# EAGLE design retrocontrolblock-blumenland-terminado-conplanodemasa (EAGLE 7.6.0)
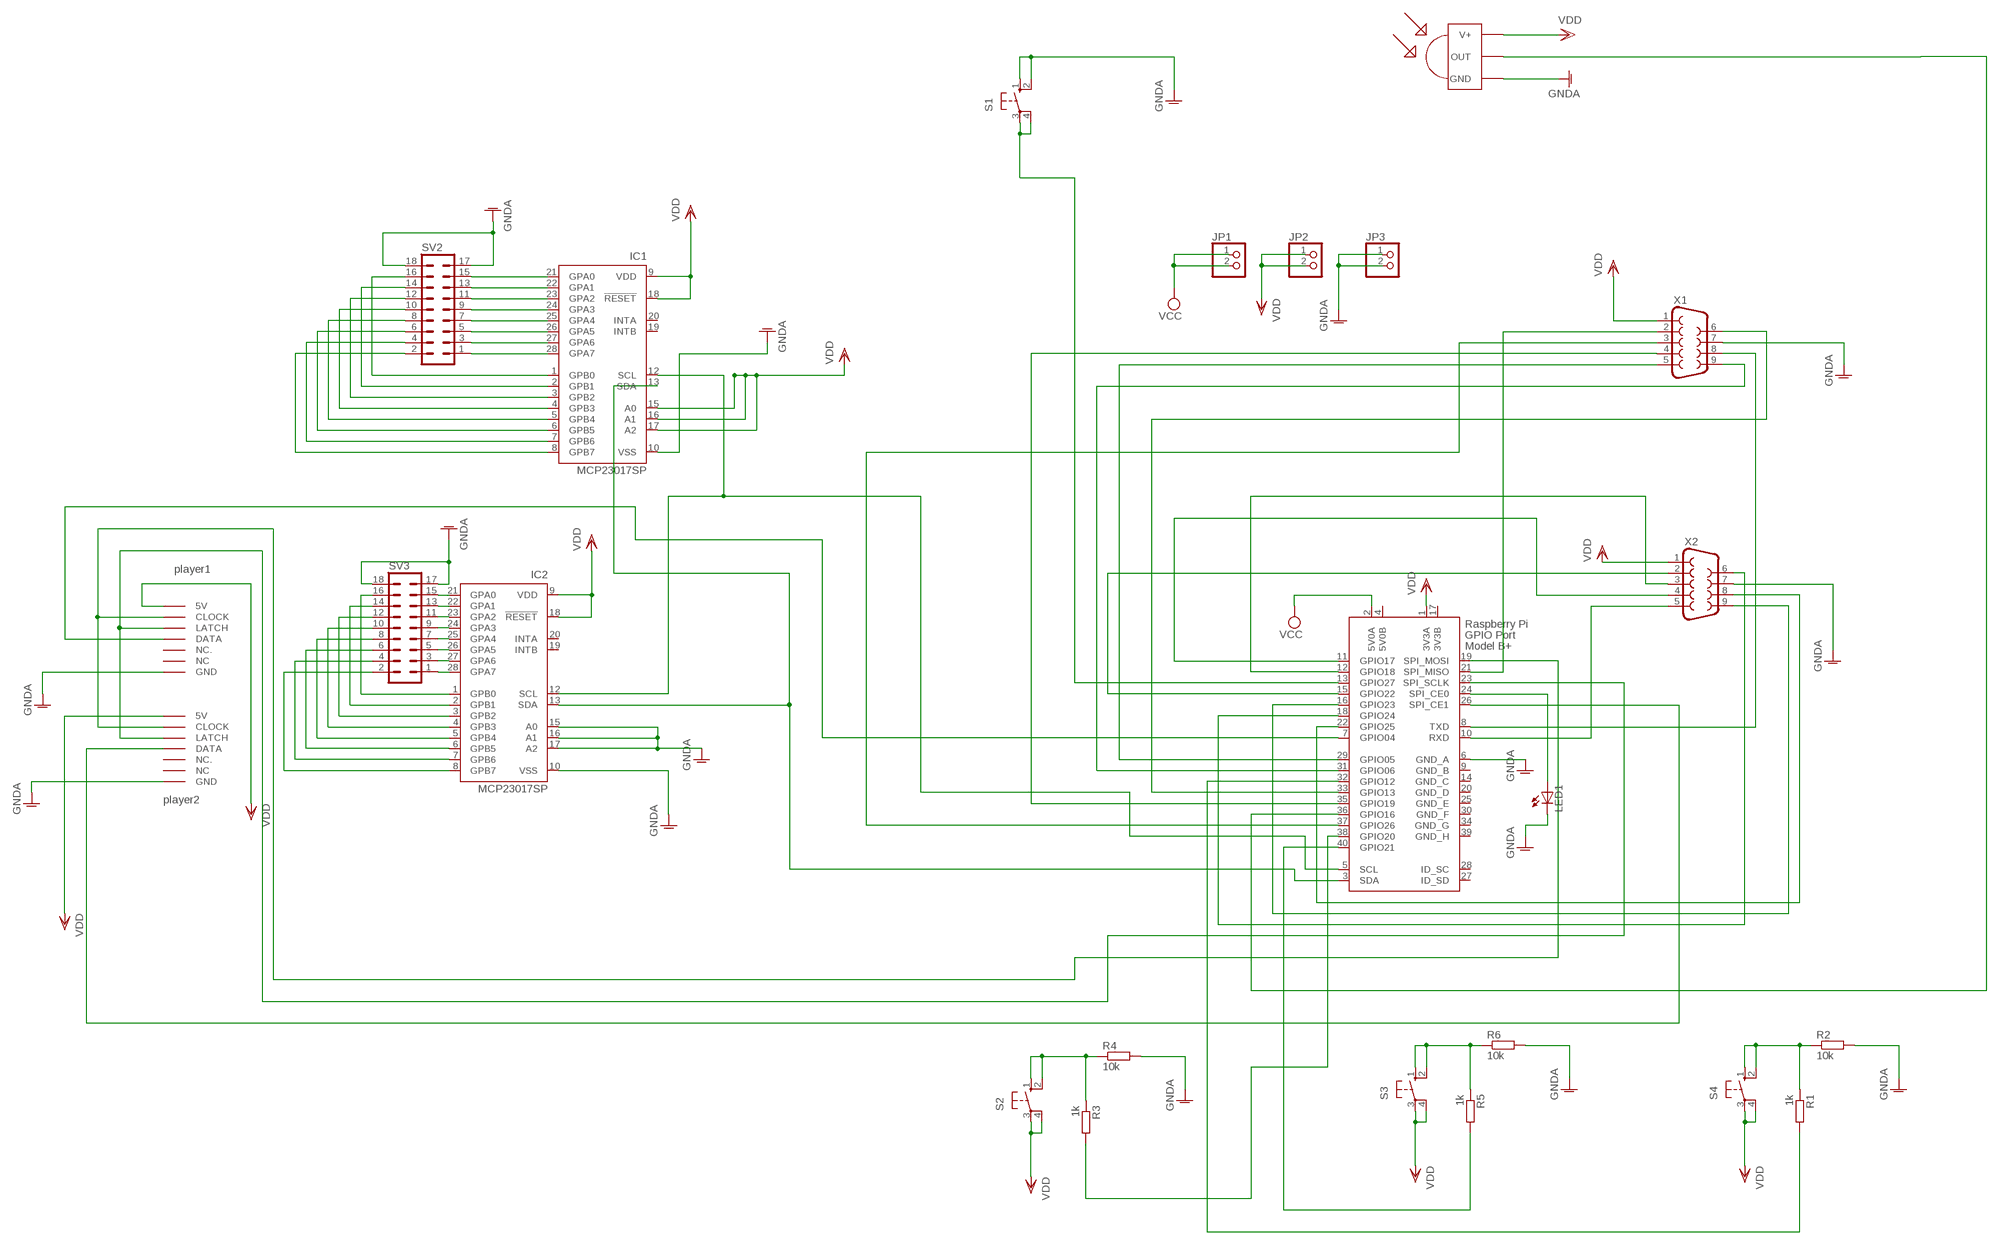
[diagram p0: schematic, sheet 1]

## Parts
IC1  MCP23017SP  [DIL28-3]
IC2  MCP23017SP  [DIL28-3]
JP1  PINHD-1X2  [1X02]
JP2  PINHD-1X2  [1X02]
JP3  PINHD-1X2  [1X02]
LED1  LED5MM  [LED5MM]
R1  1k  R-EU_0207/7  [0207/7]
R2  10k  R-EU_0207/7  [0207/7]
R3  1k  R-EU_0207/7  [0207/7]
R4  10k  R-EU_0207/7  [0207/7]
R5  1k  R-EU_0207/7  [0207/7]
R6  10k  R-EU_0207/7  [0207/7]
S1  10-XX  [B3F-10XX]
S2  10-XX  [B3F-10XX]
S3  10-XX  [B3F-10XX]
S4  10-XX  [B3F-10XX]
SV2  MA09-2  [MA09-2]
SV3  MA09-2  [MA09-2]
U$1  TSOP4838  [TSOP18XX]
U$2  SNESCONN  [SNESCONN]
U$3  SNESCONN  [SNESCONN]
X1  F09H  [F09H]
X2  F09H  [F09H]
X3  RASPI_BOARD_B+#_E0  [RASPI_BOARD_B+_EDGES_0DRILL@1]

## Nets
GNDA: IC1.10(VSS) IC2.10(VSS) IC2.15(A0) IC2.16(A1) IC2.17(A2) JP3.1 JP3.2 LED1.K(C) R2.2 R4.2 R6.2 S1.1(S) S1.2(S1) SV2.17 SV2.18 SV3.17 SV3.18 U$1.GND U$2.GND U$3.GND X1.7 X2.7 X3.6(GND_A)
N$1: IC2.2(GPB1) SV3.14
N$2: LED1.A X3.24(SPI_CE0)
N$3: R3.1 R4.1 S2.1(S) S2.2(S1)
N$4: IC1.21(GPA0) SV2.15
N$5: IC1.28(GPA7) SV2.1
N$6: IC1.1(GPB0) SV2.16
N$7: IC1.8(GPB7) SV2.2
N$8: IC2.21(GPA0) SV3.15
N$9: IC2.28(GPA7) SV3.1
N$10: IC2.1(GPB0) SV3.16
N$11: IC2.8(GPB7) SV3.2
N$12: IC1.22(GPA1) SV2.13
N$13: IC1.23(GPA2) SV2.11
N$14: IC1.24(GPA3) SV2.9
N$15: IC1.25(GPA4) SV2.7
N$16: IC1.26(GPA5) SV2.5
N$18: IC1.27(GPA6) SV2.3
N$19: IC1.2(GPB1) SV2.14
N$20: X2.5 X3.10(RXD)
N$21: IC1.3(GPB2) SV2.12
N$22: X2.3 X3.12(GPIO18)
N$23: IC1.4(GPB3) SV2.10
N$24: IC1.5(GPB4) SV2.8
N$25: R5.1 R6.1 S3.1(S) S3.2(S1)
N$26: IC1.6(GPB5) SV2.6
N$27: IC1.7(GPB6) SV2.4
N$28: IC2.7(GPB6) SV3.4
N$29: IC2.6(GPB5) SV3.6
N$30: IC2.5(GPB4) SV3.8
N$31: IC2.4(GPB3) SV3.10
N$32: IC2.3(GPB2) SV3.12
N$33: X1.5 X3.29(GPIO05)
N$34: X1.8 X3.8(TXD)
N$35: X1.9 X3.31(GPIO06)
N$36: R3.2 X3.38(GPIO20)
N$37: X1.6 X3.33(GPIO13)
N$38: X1.3 X3.37(GPIO26)
N$39: X1.4 X3.35(GPIO19)
N$41: X1.2 X3.21(SPI_MISO)
N$42: X2.4 X3.11(GPIO17)
N$43: S1.3(P) S1.4(P1) X3.13(GPIO27)
N$45: X2.2 X3.15(GPIO22)
N$46: X2.9 X3.16(GPIO23)
N$47: X2.6 X3.18(GPIO24)
N$48: X2.8 X3.22(GPIO25)
N$49: IC2.22(GPA1) SV3.13
N$50: IC2.23(GPA2) SV3.11
N$51: IC2.24(GPA3) SV3.9
N$52: IC2.25(GPA4) SV3.7
N$53: IC2.26(GPA5) SV3.5
N$54: IC2.27(GPA6) SV3.3
N$56: U$1.OUT X3.36(GPIO16)
N$58: U$3.DATA X3.7(GPIO04)
N$59: U$2.CLOCK U$3.CLOCK X3.19(SPI_MOSI)
N$60: U$2.LATCH U$3.LATCH X3.23(SPI_SCLK)
N$61: U$2.DATA X3.26(SPI_CE1)
N$63: R5.2 X3.40(GPIO21)
N$64: R1.1 R2.1 S4.1(S) S4.2(S1)
N$65: R1.2 X3.32(GPIO12)
N$120: IC1.13(SDA) IC2.13(SDA) X3.3(SDA)
N$121: IC1.12(SCL) IC2.12(SCL) X3.5(SCL)
VCC: JP1.1 JP1.2 X3.2(5V0A)
VDD: IC1.9(VDD) IC1.15(A0) IC1.16(A1) IC1.17(A2) IC1.18(!RESET) IC2.9(VDD) IC2.18(!RESET) JP2.1 JP2.2 S2.3(P) S2.4(P1) S3.3(P) S3.4(P1) S4.3(P) S4.4(P1) U$1.VCC(V+) U$2.5V U$3.5V X1.1 X2.1 X3.1(3V3A)
Unconnected: IC1.19(INTB) IC1.20(INTA) IC2.19(INTB) IC2.20(INTA) U$2.NC U$2.NC. U$3.NC U$3.NC. X3.27(ID_SD) X3.28(ID_SC)

## Notes on the sheet
- player1
- player2

## Power pins joined to a net without a drawn wire
3V3B: X3.17(3V3B)
5V0B: X3.4(5V0B)
GND_B: X3.9(GND_B)
GND_C: X3.14(GND_C)
GND_D: X3.20(GND_D)
GND_E: X3.25(GND_E)
GND_F: X3.30(GND_F)
GND_G: X3.34(GND_G)
GND_H: X3.39(GND_H)

## Library data of the parts
IC1 IC2 = microchip:MCP23017: http://ww1.microchip.com/downloads/en/DeviceDoc/21952a.pdf Source: http://ww1.microchip.com/downloads/en/DeviceDoc/21952a.pdf; MF: MICROCHIP; MPN: MCP23017-E/SP; OC_FARNELL: 1332088; OC_NEWARK: 31K2959
JP1-JP3 = pinhead:PINHD-1X2: PIN HEADER
LED1 = led:LED: LED OSRAM: - CHIPLED LG R971, LG N971, LY N971, LG Q971, LY Q971, LO R971, LY R971 LH N974, LH R974 LS Q976, LO Q976, LY Q976 LO Q996 - Hyper CHIPLED LW Q18S LB Q993, LB Q99A, LB R99A - SideLED LS A670, LO A670, LY A670, LG A670, LP A670 LB A673, LV A673, LT A673, LW A673 LH A674 LY A675 LS A676, LA A676, LO A676, LY A676, LW A676 LS A679, LY A679, LG A679 - Hyper Micro SIDELED® LS Y876, LA Y876, LO Y876, LY Y876 LT Y87S - SmartLED LW L88C, LW L88S LB L89C, LB L89S, LG L890 LS L89K, LO L89K, LY L89K LS L896, LA L896, LO L896, LY L896 - TOPLED LS T670, LO T670, LY T670, LG T670, LP T670 LSG T670, LSP T670, LSY T670, LOP T670, LYG T670 LG T671, LOG T671, LSG T671 LB T673, LV T673, LT T673, LW T673 LH T674 LS T676, LA T676, LO T676, LY T676, LB T676, LH T676, LSB T676, LW T676 LB T67C, LV T67C, LT T67C, LS T67K, LO T67K, LY T67K, LW E67C LS E67B, LA E67B, LO E67B, LY E67B, LB E67C, LV E67C, LT E67C LW T67C LS T679, LY T679, LG T679 LS T770, LO T770, LY T770, LG T770, LP T770 LB T773, LV T773, LT T773, LW T773 LH T774 LS E675, LA E675, LY E675, LS T675 LS T776, LA T776, LO T776, LY T776, LB T776 LHGB T686 LT T68C, LB T68C - Hyper Mini TOPLED® LB M676 - Mini TOPLED Santana® LG M470 LS M47K, LO M47K, LY M47K Source: http://www.osram.convergy.de LUXEON: - LUMILED® LXK2-PW12-R00, LXK2-PW12-S00, LXK2-PW14-U00, LXK2-PW14-V00 LXK2-PM12-R00, LXK2-PM12-S00, LXK2-PM14-U00 LXK2-PE12-Q00, LXK2-PE12-R00, LXK2-PE12-S00, LXK2-PE14-T00, LXK2-PE14-U00 LXK2-PB12-K00, LXK2-PB12-L00, LXK2-PB12-M00, LXK2-PB14-N00, LXK2-PB14-P00, LXK2-PB14-Q00 LXK2-PR12-L00, LXK2-PR12-M00, LXK2-PR14-Q00, LXK2-PR14-R00 LXK2-PD12-Q00, LXK2-PD12-R00, LXK2-PD12-S00 LXK2-PH12-R00, LXK2-PH12-S00 LXK2-PL12-P00, LXK2-PL12-Q00, LXK2-PL12-R00 Source: www.luxeon.com KINGBRIGHT: KA-3528ASYC Source: www.kingbright.com
R1-R6 = rcl:R-EU_: RESISTOR, European symbol
S1-S4 = switch-omron:10-XX: OMRON SWITCH; MPN: B3F-1000; OC_FARNELL: 176432; OC_NEWARK: 36M3542
SV2 SV3 = con-lstb:MA09-2: PIN HEADER; OC_FARNELL: unknown; OC_NEWARK: unknown
U$1 = tsop:TSOP4838: IR Receiver and Demodulator
U$2 U$3 = gamepad-conn:SNESCONN
X1 X2 = con-subd:F09: SUB-D; OC_FARNELL: unknown; OC_NEWARK: unknown
X3 = raspberrypi_bastelstube_v13:RASPI_BOARD_B+#: Raspberry Pi GPIO connector with markings for the outer dimensions of the Raspberry Pi board model B+ with different sets of drill holes or mounting pads All pins connected

## Net classes
0 default: width 0.254 mm
1 potencia: width 1.778 mm

## Board
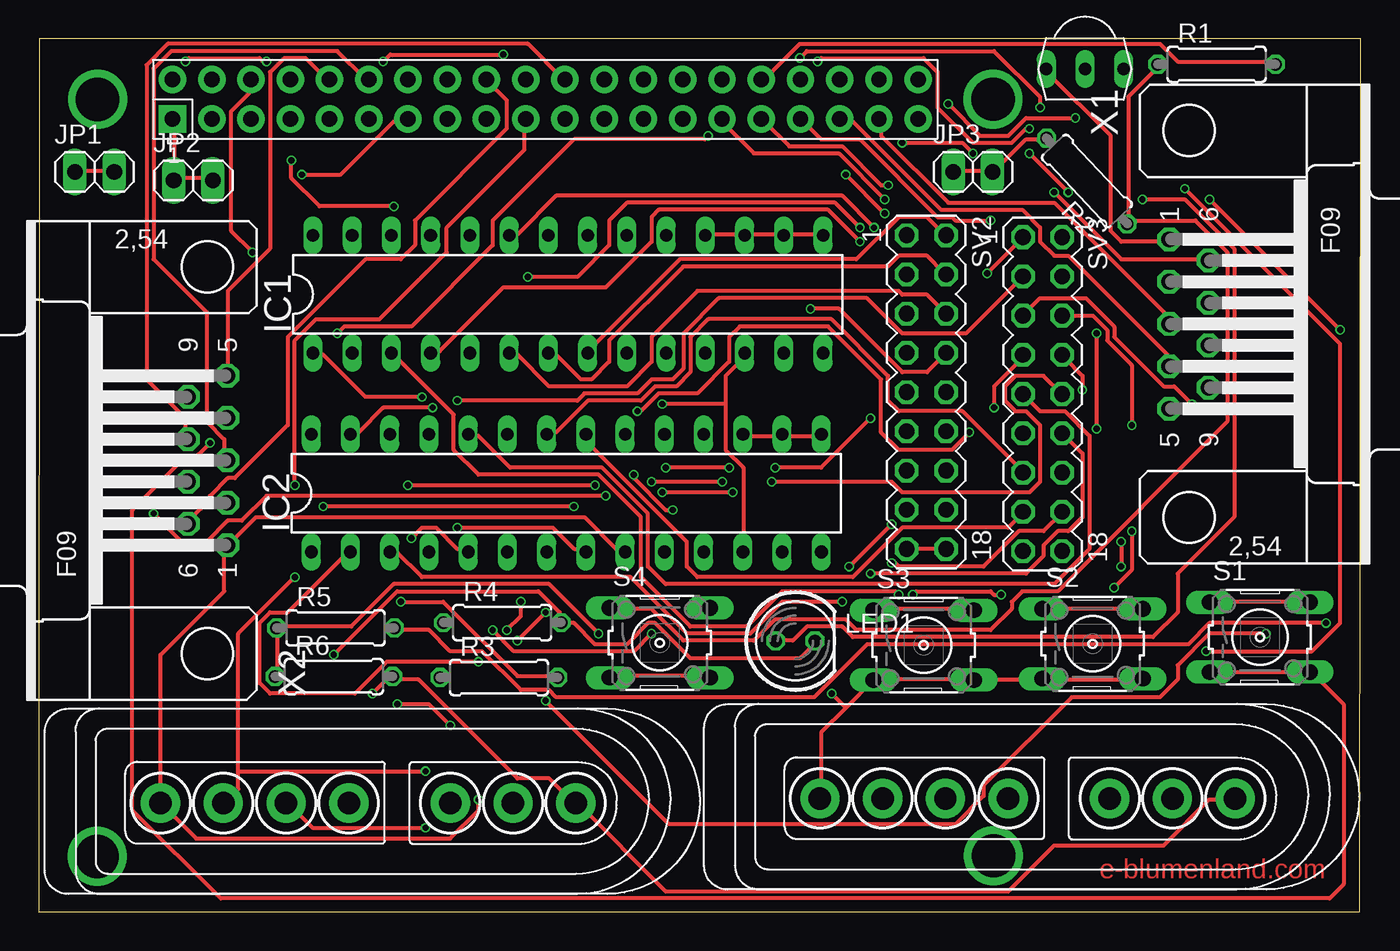
[diagram p1: board, top side]
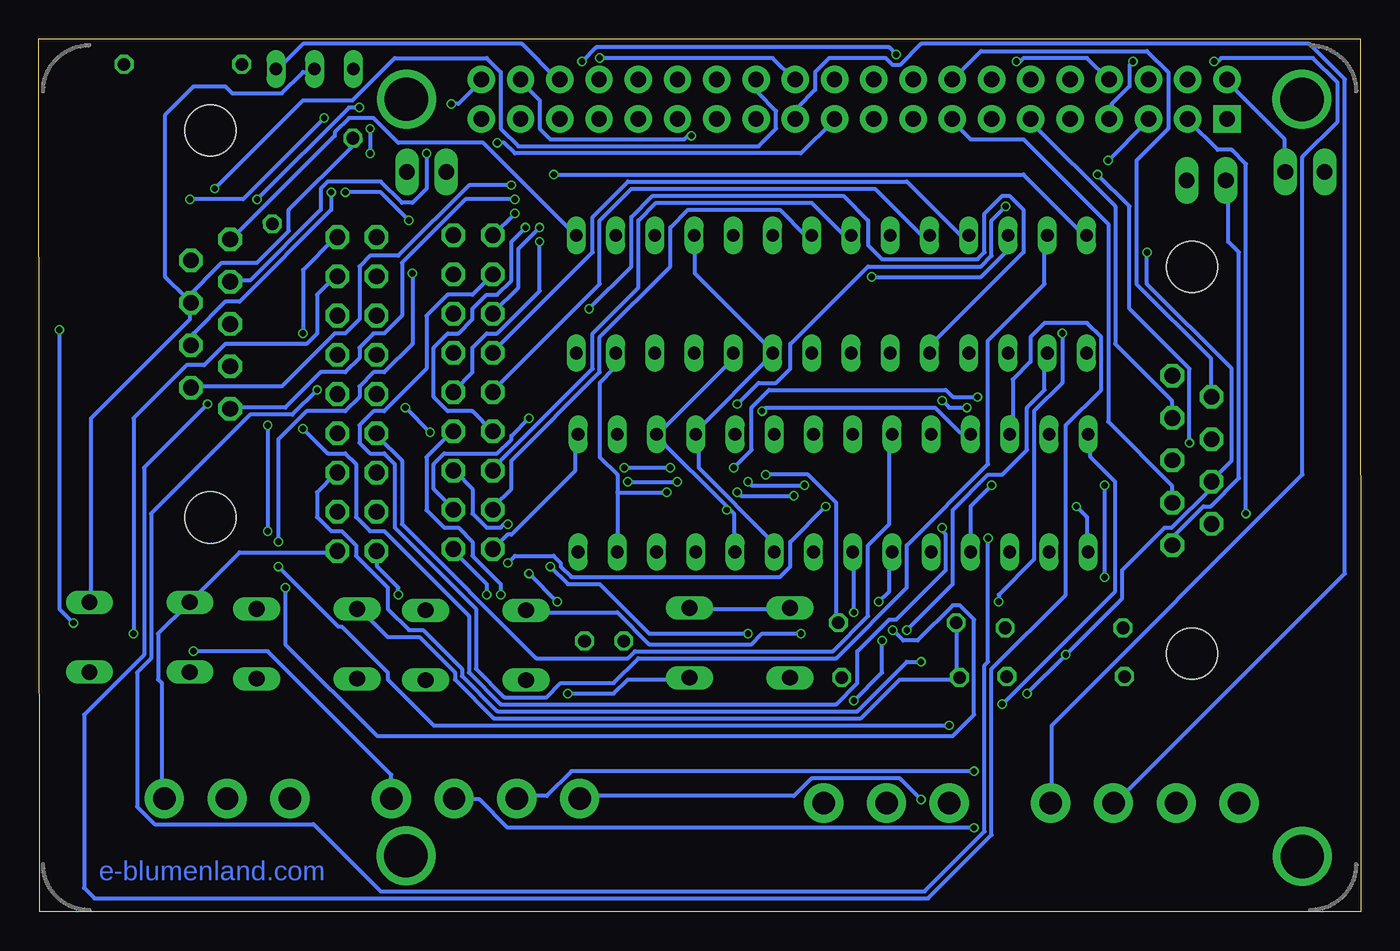
[diagram p2: board, bottom side, seen from below]

Size 85.59 x 56.54 mm. Coordinates in mm from the lower left corner, seen from the top.
Outline: 0,0 85.53,0 85.59,56.53 0.04,56.54 0,0
Copper layers (1*16): Top 0.035mm / dielectric 1.5mm / Bottom 0.035mm
Design rules "default *": minimum track width 10mil, minimum drill 16mil, track to track 8mil, track to pad 8mil, pad to pad 8mil, via to via 8mil, smd to smd 8mil, copper to edge 8mil, drill to drill 8mil, minimum pad ring 0mil, minimum via ring 3mil, stop-mask expansion 0mil, vias tented up to drill 0mil, thermal gap 0mil

### Footprints (pad centres in the part's own frame; a part is rotated, then mirrored left to right if it is on the bottom)
DIL28-3 = drill 0.813 long: 1 -16.51,-3.81; 2 -13.97,-3.81; 3 -11.43,-3.81; 4 -8.89,-3.81; 5 -6.35,-3.81; 6 -3.81,-3.81; 7 -1.27,-3.81; 8 1.27,-3.81; 9 3.81,-3.81; 10 6.35,-3.81; 11 8.89,-3.81; 12 11.43,-3.81; 13 13.97,-3.81; 14 16.51,-3.81; 15 16.51,3.81; 16 13.97,3.81; 17 11.43,3.81; 18 8.89,3.81; 19 6.35,3.81; 20 3.81,3.81; 21 1.27,3.81; 22 -1.27,3.81; 23 -3.81,3.81; 24 -6.35,3.81; 25 -8.89,3.81; 26 -11.43,3.81; 27 -13.97,3.81; 28 -16.51,3.81
1X02 = drill 1.016 long: 1 -1.27,0; 2 1.27,0
LED5MM = drill 0.813 octagon: A -1.27,0; K 1.27,0
0207/7 = drill 0.813 octagon: 1 -3.81,0; 2 3.81,0
B3F-10XX = drill 1.016 long: 1 -3.251,2.261; 2 3.251,2.261; 3 -3.251,-2.261; 4 3.251,-2.261
MA09-2 = drill 1.016 octagon: 1 -10.16,-1.27; 2 -10.16,1.27; 3 -7.62,-1.27; 4 -7.62,1.27; 5 -5.08,-1.27; 6 -5.08,1.27; 7 -2.54,-1.27; 8 -2.54,1.27; 9 0,-1.27; 10 0,1.27; 11 2.54,-1.27; 12 2.54,1.27; 13 5.08,-1.27; 14 5.08,1.27; 15 7.62,-1.27; 16 7.62,1.27; 17 10.16,-1.27; 18 10.16,1.27
TSOP18XX = drill 0.813 long: GND -0.001,-0.027; OUT -2.501,-0.027; VCC 2.499,-0.027
SNESCONN = drill 1.448 pad 2.54: 5V 0,4.064; CLOCK 4.064,4.064; DATA 12.192,4.064; GND 26.884,4.064; LATCH 8.128,4.064; NC 18.756,4.064; NC. 22.82,4.064
F09H = drill 1.016 octagon: 1 -5.486,-1.27; 2 -2.743,-1.27; 3 0,-1.27; 4 2.743,-1.27; 5 5.486,-1.27; 6 -4.115,1.27; 7 -1.372,1.27; 8 1.372,1.27; 9 4.115,1.27 | hole 3.302: -12.522,0; 12.522,0
RASPI_BOARD_B+_EDGES_0DRILL@1 = drill 1 pad 1.778 square: 1 8.37,51.23 | drill 1 pad 1.778: 2 8.37,53.77; 3 10.91,51.23; 4 10.91,53.77; 5 13.45,51.23; 6 13.45,53.77; 7 15.99,51.23; 8 15.99,53.77; 9 18.53,51.23; 10 18.53,53.77; 11 21.07,51.23; 12 21.07,53.77; 13 23.61,51.23; 14 23.61,53.77; 15 26.15,51.23; 16 26.15,53.77; 17 28.69,51.23; 18 28.69,53.77; 19 31.23,51.23; 20 31.23,53.77; 21 33.77,51.23; 22 33.77,53.77; 23 36.31,51.23; 24 36.31,53.77; 25 38.85,51.23; 26 38.85,53.77; 27 41.39,51.23; 28 41.39,53.77; 29 43.93,51.23; 30 43.93,53.77; 31 46.47,51.23; 32 46.47,53.77; 33 49.01,51.23; 34 49.01,53.77; 35 51.55,51.23; 36 51.55,53.77; 37 54.09,51.23; 38 54.09,53.77; 39 56.63,51.23; 40 56.63,53.77

### Placement (x,y rotation side)
IC1  34.26,39.99 0 top
IC2  34.16,27.11 0 top
JP1  3.62,47.9 0 top
JP2  10.01,47.36 0 top
JP3  60.48,47.92 0 top
LED1  48.98,17.54 0 top
R1  76.25,54.88 0 top
R2  67.86,47.32 133.3 top
R3  29.79,15.18 0 top
R4  30.01,18.73 0 top
R5  19.22,18.39 0 top
R6  19.11,15.24 0 top
S1  79.06,17.79 0 top
S2  68.22,17.36 0 top
S3  57.29,17.27 0 top
S4  40.21,17.42 0 top
SV2  57.47,33.66 270 top
SV3  64.99,33.53 270 top
U$1  67.73,54.55 180 top
U$2  50.57,3.28 0 top
U$3  7.89,2.98 0 top
X1  74.46,38.06 270 top
X2  10.93,29.24 90 top
X3  0.3,0.11 0 top

### Tracks (layer width: path | path; a pad name or v marks a point on that pad's centre or on a via)
GNDA  (via drill 0.41)
  Top 0.254: R2.2 65.05,50.03 63.91,50.03 61.85,47.97 JP3.2 61.62,47.97 59.33,47.97 JP3.1 | S1.1 76.02,20.08 82.19,20.08 S1.2 | SV2.17 56.36,23.51 58.65,23.51 SV2.18 | v62.31,20.54 61.85,20.54 61.62,20.76 56.82,20.76 v56.59,20.54 | 48.13,30.82 45.62,30.82 IC2.17 | 48.13,30.82 50.65,30.82 IC2.15 | 48.13,30.82 IC2.16 | LED1.K 50.19,17.34 49.28,16.42 42.19,16.42 39.9,18.71 39.45,18.71 38.07,17.34 36.02,17.34 34.65,18.71 33.96,18.71 R4.2 33.73,18.94 33.73,19.39 32.36,20.76 23.22,20.76 v19.1,16.65 | v21.62,14.14 22.76,15.28 R6.2 22.99,15.05 24.59,15.05 30.99,8.65 33.05,8.65 34.65,7.05 U$3.GND 34.87,7.05 40.59,1.33 62.76,1.33 65.73,4.31 72.82,4.31 75.79,7.28 77.39,7.28 U$2.GND | v13.84,42.71 12.47,44.08 12.47,51.85 13.61,53 13.61,53.68 X3.6 | v41.05,26.02 40.59,26.02 38.53,28.08 v38.53,28.31
  Bottom 0.254: 76.02,39.74 75.79,39.51 X1.7 | 76.02,39.74 77.39,41.11 77.39,51.63 75.56,53.45 73.51,53.45 73.05,53 69.85,53 68.48,54.37 67.79,54.37 U$1.GND | 76.02,39.74 73.74,42.02 71.45,42.02 69.39,44.08 69.39,45.45 65.28,49.57 65.28,50.03 R2.2 | 76.02,39.74 X1.7 | SV3.18 66.42,23.28 72.59,23.28 75.79,20.08 S1.1 76.02,19.85 77.85,18.02 77.85,15.05 77.62,14.82 77.62,7.51 U$2.GND | X1.7 75.79,39.28 75.79,38.37 82.19,31.97 82.19,20.08 S1.2 | v62.31,20.54 62.31,20.99 63.68,22.36 63.68,23.28 SV3.17 | v56.59,20.54 56.59,21.22 58.65,23.28 SV2.18 | 41.05,26.25 45.62,30.82 IC2.17 45.39,31.05 40.82,35.62 40.82,36.08 IC1.10 | 41.05,26.25 40.59,25.79 40.59,23.51 IC2.10 | SV2.17 56.13,23.51 55.22,24.42 54.99,24.42 50.88,28.54 50.88,30.82 IC2.15 | v21.62,14.14 v19.1,16.65 15.44,20.31 15.44,22.14 12.7,24.88 12.24,24.88 9.73,27.39 9.73,27.85 X2.7 9.5,28.08 8.36,29.22 8.36,35.17 13.84,40.65 v13.84,42.71 | v41.05,26.02 41.05,26.25 | v38.53,28.31 35.79,28.31 33.96,26.48 33.96,18.94 R4.2
N$1  (via drill 0.41)
  Top 0.254: v28.47,16.19 22.53,16.19 20.47,14.14 14.99,14.14 14.3,14.82 14.3,18.71 14.99,19.39 16.13,19.39 20.01,23.28 IC2.2
  Bottom 0.254: v28.47,16.19 29.39,16.19 32.59,12.99 55.91,12.99 58.19,15.28 58.19,15.74 60.71,18.25 61.62,18.25 62.99,19.62 62.99,20.99 65.05,23.05 65.05,23.74 65.96,24.65 66.65,24.65 67.56,25.57 67.56,27.17 66.42,28.31 SV3.14
N$2  (via drill 0.41)
  Top 0.254: v71.45,46.14 74.19,46.14 77.39,42.94 77.39,25.57 73.74,21.91 73.74,19.39 72.14,17.79 52.7,17.79 52.02,18.48 49.73,18.48 48.82,17.56 47.9,17.56 LED1.A | v64.82,52.08 64.82,52.77 61.85,55.74 49.73,55.74 v49.28,55.28
  Bottom 0.254: v71.45,46.14 65.51,52.08 v64.82,52.08 | v49.28,55.28 38.07,55.28 36.7,53.91 X3.24
N$3
  Top 0.254: S2.2 S2.1
  Bottom 0.254: R4.1 26.19,18.71 26.19,15.28 R3.1 26.19,15.05 29.84,15.05 32.36,12.54 56.13,12.54 58.65,15.05 58.65,15.51 60.93,17.79 62.99,17.79 64.82,19.62 S2.1
N$4
  Bottom 0.254: IC1.21 35.56,43.85 36.02,43.85 37.62,45.45 43.56,45.45 44.7,44.31 44.7,41.8 49.28,37.22 49.28,34.94 54.99,29.22 54.99,27.39 56.13,26.25 SV2.15
N$5  (via drill 0.41)
  Top 0.254: v54.76,45.22 v52.25,47.74
  Bottom 0.254: v52.25,47.74 21.84,47.74 17.96,43.85 IC1.28 | v54.76,45.22 56.13,43.85 SV2.1
N$6  (via drill 0.41)
  Top 0.254: v24.82,33.34 21.16,33.34 18.41,36.08 17.96,36.08 IC1.1 | v44.7,28.77 v40.59,28.77 | v47.68,28.77 50.65,28.77 v53.85,31.97
  Bottom 0.254: v24.82,33.34 26.42,33.34 26.87,33.79 38.3,33.79 39.45,32.65 39.45,29.91 v40.59,28.77 | v47.68,28.77 v44.7,28.77 | v53.85,31.97 54.99,30.82 54.99,30.59 55.91,29.68 59.33,29.68 60.02,28.99 60.02,27.39 58.88,26.25 SV2.16
N$7
  Top 0.254: IC1.8 35.56,36.31 41.5,42.25 52.93,42.25 55.68,45 57.51,45 58.65,43.85 SV2.2
N$8
  Top 0.254: IC2.21 35.56,30.82 35.56,30.37 41.96,23.97 41.96,22.36 42.65,21.68 52.7,21.68 55.91,24.88 62.76,24.88 63.68,25.79 SV3.15
N$9  (via drill 0.41)
  Top 0.254: v23.22,13.45 25.27,13.45 v26.64,12.08 | v70.08,23.97 v70.08,22.36 | v61.39,41.34 63.68,43.62 SV3.1
  Bottom 0.254: v23.22,13.45 15.9,20.76 15.9,27.85 17.5,29.45 17.5,30.82 IC2.28 | v26.64,12.08 60.02,12.08 62.99,15.05 62.99,15.51 65.96,18.48 66.19,18.48 v70.08,22.36 | v70.08,23.97 70.08,30.59 68.25,32.42 65.73,32.42 64.82,33.34 64.82,34.02 63.91,34.94 63.22,34.94 61.39,36.77 v61.39,41.34
N$10  (via drill 0.41)
  Top 0.254: v34.65,26.25 v18.41,26.25 | v55.22,22.59 55.45,22.59 55.68,22.36 61.16,22.36 63.45,24.65 65.05,24.65 66.19,25.79 SV3.16
  Bottom 0.254: v18.41,26.25 17.73,25.57 17.73,23.51 IC2.1 | v34.65,26.25 36.93,23.97 36.93,22.36 37.62,21.68 51.1,21.68 51.79,22.36 51.79,22.59 52.25,23.05 54.76,23.05 v55.22,22.59
N$11  (via drill 0.41)
  Top 0.254: v27.1,24.88 33.27,24.88 34.65,23.51 35.33,23.51 IC2.8 | v68.48,37.45 v68.48,31.28
  Bottom 0.254: v27.1,24.88 27.1,24.65 26.87,24.42 26.87,22.14 30.07,18.94 30.53,18.94 32.59,16.88 32.59,14.82 33.96,13.45 55.68,13.45 57.73,15.51 57.73,19.16 63.22,24.65 64.13,24.65 65.05,25.57 65.05,28.99 65.73,29.68 66.88,29.68 v68.48,31.28 | v68.48,37.45 68.48,41.57 66.42,43.62 SV3.2
N$12
  Bottom 0.254: IC1.22 33.05,43.85 33.5,43.85 35.56,45.91 45.62,45.91 46.76,44.77 46.76,40.42 49.73,37.45 49.73,35.17 56.13,28.77 SV2.13
N$13  (via drill 0.41)
  Top 0.254: v54.08,44.31 52.02,46.37 33.5,46.37 30.99,43.85 30.53,43.85 IC1.23
  Bottom 0.254: v54.08,44.31 54.99,43.4 54.99,40.88 55.91,39.97 56.59,39.97 57.51,39.05 57.51,38.37 58.42,37.45 59.11,37.45 60.02,36.54 60.02,33.34 59.11,32.42 57.51,32.42 SV2.11
N$14
  Bottom 0.254: IC1.24 28.02,43.85 28.47,43.85 31.44,46.83 47.22,46.83 49.28,44.77 49.28,40.65 56.13,33.79 SV2.9
N$15
  Bottom 0.254: IC1.25 25.5,43.85 25.96,43.85 29.39,47.28 47.45,47.28 49.73,45 49.73,42.71 56.13,36.31 SV2.7
N$16  (via drill 0.41)
  Top 0.254: v31.67,41.11 34.87,41.11 36.93,43.17 36.93,44.77 38.07,45.91 51.56,45.91 v53.16,44.31
  Bottom 0.254: v31.67,41.11 24.59,41.11 22.99,42.71 22.99,43.62 IC1.26 | v53.16,44.31 54.53,42.94 54.53,40.42 56.13,38.82 SV2.5
N$18
  Bottom 0.254: SV2.3 57.51,39.97 59.11,39.97 60.48,38.6 60.48,35.17 63.22,32.42 63.91,32.42 64.82,31.51 64.82,30.37 64.13,29.68 63.22,29.68 62.53,28.99 62.53,24.88 57.28,19.62 57.28,15.74 55.45,13.91 52.7,13.91 51.79,14.82 48.36,14.82 46.76,16.42 33.96,16.42 29.39,20.99 29.39,23.74 24.13,28.99 24.13,37 20.47,40.65 20.47,43.62 IC1.27
N$19  (via drill 0.41)
  Top 0.254: v29.39,18.25 30.76,16.88 38.53,16.88 v39.67,18.02 | v55.22,25.11 v52.48,22.36
  Bottom 0.254: v29.39,18.25 26.42,21.22 26.42,26.02 24.13,28.31 23.22,28.31 21.62,29.91 21.62,32.65 20.47,33.79 20.47,36.08 IC1.2 | v39.67,18.02 46.08,18.02 49.28,21.22 51.33,21.22 v52.48,22.36 | v55.22,25.11 55.45,25.11 55.68,24.88 56.59,24.88 57.51,25.79 57.51,27.39 58.65,28.54 SV2.14
N$20
  Top 0.254: X2.5 12.24,34.94 12.24,40.2 14.99,42.94 14.99,54.37 15.9,55.28 17.27,55.28 18.64,53.91 X3.10
N$21  (via drill 0.41)
  Top 0.254: v55.68,20.54 55.45,20.76 48.13,20.76 45.85,18.48 42.19,18.48 38.99,21.68 38.99,25.57 36.25,28.31 28.47,28.31 26.87,29.91 26.87,32.19 22.99,36.08 IC1.3
  Bottom 0.254: v55.68,20.54 55.68,21.22 57.51,23.05 57.51,23.97 58.42,24.88 59.33,24.88 60.48,26.02 60.48,29.45 58.88,31.05 SV2.12
N$22
  Top 0.254: X2.3 12.01,29.45 12.01,30.59 10.87,31.74 10.87,38.82 7.44,42.25 7.44,54.6 8.58,55.74 19.33,55.74 21.16,53.91 X3.12
N$23  (via drill 0.41)
  Top 0.254: v53.16,43.4 51.1,45.45 40.13,45.45 39.67,45 39.67,43.4 36.7,40.42 30.07,40.42 25.96,36.31 25.5,36.31 IC1.4
  Bottom 0.254: v53.16,43.4 53.16,40.2 55.91,37.45 56.59,37.45 57.51,36.54 57.51,34.94 58.65,33.79 SV2.10
N$24  (via drill 0.41)
  Top 0.254: v49.96,39.05 51.79,39.05 55.91,34.94 57.51,34.94 58.65,36.08 SV2.8
  Bottom 0.254: v49.96,39.05 47.22,41.8 47.22,45 45.85,46.37 33.5,46.37 31.9,44.77 31.9,43.17 30.99,42.25 24.82,42.25 24.36,42.71 24.36,45.22 23.22,46.37 22.76,46.37 21.84,45.45 21.84,42.71 27.79,36.77 27.79,36.31 IC1.5
N$25  (via drill 0.41)
  Top 0.254: R6.1 15.44,15.28 15.44,18.25 R5.1 15.44,18.48 20.24,18.48 22.99,21.22 33.05,21.22 v36.25,18.02 | S3.1 54.08,19.62 60.48,19.62 S3.2
  Bottom 0.254: v36.25,18.02 38.76,18.02 39.45,17.34 46.08,17.34 48.13,19.39 53.85,19.39 S3.1
N$26
  Top 0.254: SV2.6 57.51,39.97 55.91,39.97 55.68,40.2 42.65,40.2 39.67,37.22 39.67,35.62 38.07,34.02 33.05,34.02 30.99,36.08 30.53,36.08 IC1.6
N$27
  Top 0.254: IC1.7 33.05,36.08 33.5,36.08 35.1,34.48 35.79,34.48 36.93,35.62 36.93,37 41.73,41.8 54.99,41.8 55.68,42.48 57.51,42.48 58.65,41.34 SV2.4
N$28  (via drill 0.41)
  Top 0.254: v30.99,17.56 v32.82,19.39 | v32.82,13.68 40.82,5.68 59.33,5.68 61.16,7.51 61.16,8.19 66.88,13.91 72.59,13.91 73.74,15.05 73.74,15.96 75.79,18.02 v79.45,18.02
  Bottom 0.254: v32.82,19.39 32.82,23.28 IC2.7 | v30.99,17.56 30.99,15.51 v32.82,13.68 | v79.45,18.02 79.45,31.97 76.02,35.4 74.88,35.4 73.51,36.77 68.25,36.77 67.56,37.45 67.56,39.97 66.42,41.11 SV3.4
N$29  (via drill 0.41)
  Top 0.254: v31.22,20.08 31.22,19.16 v30.3,18.25 | v69.62,20.99 70.76,22.14 v70.76,24.65 | v70.76,31.51 70.76,35.4 69.16,37 69.16,37.68 68.25,38.6 66.42,38.6 SV3.6
  Bottom 0.254: v31.22,20.08 30.53,20.76 30.53,23.28 IC2.6 | v30.3,18.25 29.62,17.56 28.7,17.56 26.42,19.85 25.96,19.85 25.04,18.94 25.04,12.76 26.42,11.39 63.68,11.39 69.62,17.34 v69.62,20.99 | v70.76,31.51 v70.76,24.65
N$30  (via drill 0.41)
  Top 0.254: v24.13,24.19 24.82,24.88 25.73,24.88 27.1,23.51 27.79,23.51 IC2.5 | v67.56,33.79 67.56,34.71 66.42,35.85 SV3.8
  Bottom 0.254: v24.13,24.19 24.13,16.19 24.36,15.96 24.36,5.22 28.24,1.33 63.45,1.33 67.79,5.68 78.08,5.68 79.22,6.82 79.22,15.51 78.31,16.42 78.31,25.79 71.91,32.19 69.16,32.19 v67.56,33.79
N$31  (via drill 0.41)
  Top 0.254: v36.02,27.62 v23.9,27.62 | v44.25,27.85 v39.67,27.85 | v47.45,27.85 55.22,27.85 55.91,27.17 64.13,27.17 64.82,27.85 64.82,31.51 63.91,32.42 63.22,32.42 62.53,33.11 62.53,34.02 63.22,34.71 65.05,34.71 66.19,33.57 SV3.10
  Bottom 0.254: IC2.4 25.27,26.25 v23.9,27.62 | v36.02,27.62 39.45,27.62 v39.67,27.85 | v47.45,27.85 v44.25,27.85
N$32  (via drill 0.41)
  Top 0.254: v52.02,20.08 48.13,20.08 46.08,18.02 41.96,18.02 38.3,21.68 24.82,21.68 23.22,23.28 22.76,23.28 IC2.3 | v53.85,21.91 63.91,21.91 65.05,23.05 65.05,23.74 65.96,24.65 66.65,24.65 67.56,25.57 67.56,29.68 SV3.12
  Bottom 0.254: v53.85,21.91 v52.02,20.08
N$33  (via drill 0.41)
  Top 0.254: v54.76,46.14 51.79,49.11 46.3,49.11 44.25,51.17 X3.29
  Bottom 0.254: v54.76,46.14 57.96,46.14 62.08,42.02 62.08,38.6 63.22,37.45 63.91,37.45 64.82,36.54 64.82,35.85 65.73,34.94 67.34,34.94 69.62,32.65 73.05,32.65 X1.5
N$34  (via drill 0.41)
  Top 0.254: v64.13,49.11 v66.65,46.6 | v64.13,50.71 63.91,50.71 62.99,49.8 60.48,49.8 58.19,52.08 58.19,54.37 57.28,55.28 50.65,55.28 v50.42,55.05 | v30.07,55.51 22.76,55.51 v22.3,55.05
  Bottom 0.254: v66.65,46.6 66.65,45.45 72.59,39.51 73.51,39.51 75.56,37.45 75.56,36.77 X1.8 | v64.13,50.71 v64.13,49.11 | v50.42,55.05 49.5,55.97 30.53,55.97 v30.07,55.51 | v22.3,55.05 22.07,55.05 21.84,55.28 17.73,55.28 16.36,53.91 X3.8
N$35  (via drill 0.41)
  Top 0.254: v54.99,47.05 54.53,47.05 52.02,49.57 48.59,49.57 46.99,51.17 X3.31
  Bottom 0.254: v54.99,47.05 57.73,47.05 62.31,42.48 64.13,42.48 64.82,41.8 64.82,38.37 65.73,37.45 66.42,37.45 69.85,34.02 75.56,34.02 X1.9
N$36  (via drill 0.41)
  Top 0.254: v23.44,20.08 26.19,20.08 30.99,15.28 33.5,15.28 R3.2 | v19.33,37.45 19.79,37.91 24.13,37.91 29.39,43.17 29.39,44.77 34.65,50.03 43.1,50.03 v43.33,50.25
  Bottom 0.254: v23.44,20.08 23.44,20.54 21.16,22.82 21.16,32.42 19.33,34.25 v19.33,37.45 | v43.33,50.25 43.56,50.25 43.79,50.03 52.48,50.03 53.16,50.71 53.16,52.54 54.3,53.68 X3.38
N$37  (via drill 0.41)
  Top 0.254: v65.73,46.6 70.08,42.25 75.56,42.25 X1.6 | v61.62,44.77 59.33,44.77 59.11,45 58.19,45 53.16,50.03 50.65,50.03 49.5,51.17 X3.33
  Bottom 0.254: v65.73,46.6 63.45,46.6 v61.62,44.77
N$38
  Top 0.254: X1.3 73.05,38.14 73.05,38.6 65.73,45.91 58.88,45.91 54.53,50.25 54.53,51.17 X3.37
N$39
  Top 0.254: X1.4 73.05,35.4 73.05,36.08 66.65,42.48 65.73,42.48 64.82,43.4 64.82,44.31 63.68,45.45 58.42,45.45 52.7,51.17 52.02,51.17 X3.35
N$40  (via drill 2.8 pad 3.81)
  other vias: 3.8,3.59
N$41  (via drill 0.41)
  Top 0.254: v60.48,49.11 59.79,49.8 v55.91,49.8
  Bottom 0.254: v60.48,49.11 60.48,46.83 61.39,45.91 62.08,45.91 63.45,47.28 66.88,47.28 67.34,46.83 67.34,45.45 71.91,40.88 73.05,40.88 X1.2 | v55.91,49.8 55.45,49.8 54.76,49.11 36.25,49.11 34.19,51.17 X3.21
N$42
  Bottom 0.254: X2.4 12.24,32.19 12.24,33.11 15.9,36.77 15.9,45.68 21.39,51.17 X3.11
N$43  (via drill 0.41)
  Top 0.254: S1.3 76.02,15.51 82.19,15.51 S1.4 82.42,15.51 84.48,13.45 84.48,1.79 83.57,0.88 11.79,0.88 6.07,6.59 6.07,26.02 9.04,28.99 9.73,28.99 v11.1,30.37 | v17.04,47.74 19.56,47.74 22.99,51.17 23.9,51.17 X3.13
  Bottom 0.254: v17.04,47.74 14.99,45.68 14.99,39.05 11.1,35.17 v11.1,30.37
N$44  (via drill 2.8 pad 3.81)
  other vias: 61.81,3.63
N$45
  Bottom 0.254: X2.2 12.24,26.71 12.24,27.62 16.36,31.74 16.36,44.54 21.84,50.03 25.27,50.03 26.42,51.17 X3.15
N$46
  Bottom 0.254: X2.9 9.73,33.57 9.73,35.85 14.53,40.65 14.53,48.65 12.47,50.71 12.47,54.37 13.84,55.74 24.59,55.74 26.42,53.91 X3.16
N$47
  Top 0.254: X2.6 9.73,25.34 11.1,26.71 11.1,26.94 12.24,28.08 12.7,28.08 16.13,31.51 16.13,37.22 21.16,42.25 23.44,42.25 24.36,43.17 24.36,44.77 30.3,50.71 30.3,52.54 29.16,53.68 X3.18
N$48
  Top 0.254: X2.8 9.5,30.82 9.5,31.97 6.98,34.48 6.98,54.83 8.36,56.2 31.67,56.2 33.96,53.91 X3.22
N$49
  Top 0.254: IC2.22 33.05,31.05 33.5,31.05 35.56,33.11 38.99,33.11 39.9,34.02 41.27,34.02 42.19,34.94 42.19,37.22 43.33,38.37 51.33,38.37 54.99,34.71 54.99,33.11 55.68,32.42 59.79,32.42 63.68,28.54 SV3.13
N$50
  Bottom 0.254: IC2.23 30.53,30.82 30.53,25.11 31.9,23.74 31.9,19.16 34.19,16.88 46.99,16.88 47.45,16.42 53.39,16.42 62.08,25.11 62.08,29.22 63.68,30.82 SV3.11
N$51
  Top 0.254: SV3.9 64.82,32.42 66.42,32.42 68.02,30.82 68.02,23.51 65.73,21.22 40.59,21.22 39.45,22.36 39.45,25.79 36.47,28.77 30.53,28.77 28.47,30.82 28.02,30.82 IC2.24
N$52  (via drill 0.41)
  Top 0.254: v38.76,32.42 38.99,32.42 40.13,33.57 42.65,33.57 44.7,35.62 44.7,37.22 45.39,37.91 51.1,37.91 54.53,34.48 54.53,31.05 55.68,29.91 59.11,29.91 v60.25,31.05 | v61.85,32.65 61.85,34.02 63.68,35.85 SV3.7
  Bottom 0.254: v38.76,32.42 38.53,32.65 27.56,32.65 25.96,31.05 25.27,31.05 IC2.25 | v61.85,32.65 v60.25,31.05
N$53  (via drill 0.41)
  Top 0.254: v74.65,32.88 73.51,34.02 72.82,34.02 69.62,37.22 69.62,37.91 67.79,39.74 64.82,39.74 63.91,38.82 SV3.5
  Bottom 0.254: v74.65,32.88 78.77,28.77 78.77,16.65 82.65,12.76 82.65,1.56 81.97,0.88 28.02,0.88 23.9,4.99 23.9,15.74 19.1,20.54 19.1,31.51 16.81,33.79 16.81,37.22 17.73,38.14 20.47,38.14 21.39,37.22 21.39,35.62 22.53,34.48 22.53,31.05 IC2.26
N$54  (via drill 0.41)
  Top 0.254: v25.5,32.65 22.3,32.65 20.7,31.05 20.24,31.05 IC2.27 | v27.1,33.11 34.87,33.11 35.33,33.57 38.76,33.57 39.67,34.48 41.05,34.48 41.73,35.17 41.73,37.45 44.02,39.74 53.62,39.74 55.91,37.45 60.02,37.45 SV3.3
  Bottom 0.254: v25.5,32.65 26.64,32.65 v27.1,33.11
N$55  (via drill 2.8 pad 3.81)
  other vias: 61.79,52.62
N$56
  Bottom 0.254: U$1.OUT 70.08,54.6 68.48,56.2 54.3,56.2 52.02,53.91 X3.36
N$57  (via drill 2.8 pad 3.81)
  other vias: 3.81,52.6
N$58  (via drill 0.41)
  Top 0.254: v14.76,55.05 14.53,55.05 14.3,55.28 9.73,55.28 v9.5,55.05
  Bottom 0.254: v14.76,55.05 14.99,54.83 14.99,53.45 16.13,52.31 16.13,51.4 X3.7 | v9.5,55.05 9.27,55.05 9.04,55.28 3.1,55.28 1.5,53.68 1.5,51.17 3.78,48.88 3.78,28.31 20.01,12.08 20.01,7.05 U$3.DATA
N$59  (via drill 0.41)
  Top 0.254: v16.59,27.62 16.59,37 17.96,38.37 22.07,38.37 26.42,42.71 26.42,44.31 31.44,49.34 31.44,51.17 X3.19 | v16.59,21.68 12.93,18.02 12.93,9.11 | 12.93,9.11 12.93,7.96 12.01,7.05 U$3.CLOCK | 12.93,9.11 v25.04,9.11
  Bottom 0.254: v16.59,21.68 v16.59,27.62 | v25.04,9.11 51.1,9.11 52.7,7.51 54.53,7.51 U$2.CLOCK
N$60  (via drill 0.41)
  Top 0.254: v25.04,5.45 17.73,5.45 16.13,7.05 U$3.LATCH
  Bottom 0.254: X3.23 36.47,51.4 36.47,52.08 35.33,53.23 35.33,54.37 34.42,55.28 30.76,55.28 30.3,54.83 29.84,54.83 28.47,56.2 3.33,56.2 1.04,53.91 1.04,21.91 15.9,7.05 U$3.LATCH | v25.04,5.45 55.22,5.45 57.05,7.28 58.65,7.28 U$2.LATCH
N$61  (via drill 0.41)
  Top 0.254: v74.19,46.83 84.25,36.77 84.25,18.71 82.42,16.88 v75.56,16.88
  Bottom 0.254: v74.19,46.83 68.48,52.54 65.28,52.54 62.53,55.28 56.59,55.28 55.68,54.37 55.68,50.71 54.53,49.57 38.99,49.57 37.85,50.71 37.85,51.85 38.99,53 38.99,53.68 X3.26 | v75.56,16.88 70.76,16.88 62.76,8.88 U$2.DATA
N$63  (via drill 0.41)
  Top 0.254: v83.34,18.71 75.79,18.71 74.42,17.34 53.62,17.34 50.19,13.91 33.5,13.91 33.05,14.36 31.22,14.36 28.7,16.88 26.64,16.88 25.27,18.25 23.22,18.25 R5.2 | v75.79,46.14 v84.25,37.68 | v67.11,51.4 63.91,51.4 62.76,50.25 60.93,50.25 v58.88,52.31
  Bottom 0.254: v83.34,18.71 84.25,19.62 v84.25,37.68 | v75.79,46.14 72.36,46.14 v67.11,51.4 | v58.88,52.31 58.42,52.31 57.05,53.68 X3.40
N$64
  Top 0.254: 70.54,44.77 70.54,52.77 72.59,54.83 R1.1 | 70.54,44.77 74.88,44.77 76.94,42.71 76.94,31.74 65.96,20.76 63.68,20.76 62.99,20.08 62.99,19.62 61.62,18.25 52.93,18.25 52.25,18.94 47.68,18.94 46.3,17.56 41.73,17.56 39.67,19.62 37.16,19.62 S4.1 | 70.54,44.77 R2.1
  Bottom 0.254: S4.1 37.16,19.62 43.33,19.62 S4.2
N$65
  Top 0.254: R1.2 79.91,55.05 73.74,55.05 72.59,56.2 49.28,56.2 46.99,53.91 X3.32
N$120  (via drill 0.41)
  Top 0.254: v7.44,25.79 9.27,23.97 10.87,23.97 12.24,25.34 13.16,25.34 14.76,26.94 v36.7,26.94 | v44.93,27.17 v40.36,27.17
  Bottom 0.254: 48.13,27.17 48.13,28.31 49.28,29.45 49.28,34.25 48.36,35.17 48.36,36.08 IC1.13 | 48.13,27.17 IC2.13 | v7.44,25.79 7.44,48.43 8.36,49.34 9.27,49.34 11.1,51.17 X3.3 | v36.7,26.94 40.13,26.94 v40.36,27.17 | 48.13,27.17 v44.93,27.17
N$121  (via drill 0.41)
  Top 0.254: 44.48,32.88 44.48,34.71 45.85,36.08 IC1.12 | 44.48,32.88 44.48,29.91 45.62,28.77 45.62,23.51 IC2.12 | v16.36,48.65 16.36,47.51 18.19,45.68 v22.99,45.68 | 44.48,32.88 v40.36,32.88
  Bottom 0.254: v16.36,48.65 13.84,51.17 X3.5 | v22.99,45.68 23.9,44.77 23.9,42.48 24.59,41.8 31.9,41.8 36.93,36.77 36.93,35.17 37.85,34.25 38.99,34.25 v40.36,32.88
VCC
  Top 0.254: JP1.1 2.41,47.97 4.7,47.97 JP1.2
  Bottom 0.254: X3.2 8.58,53.68 4.93,50.03 4.93,47.97 JP1.2
VDD  (via drill 0.41)
  Top 0.254: U$1.VCC 65.28,54.37 69.39,50.25 69.39,44.08 70.08,43.4 73.05,43.4 X1.1 | IC1.18 43.33,43.85 45.62,43.85 IC1.17 45.85,43.85 48.13,43.85 IC1.16 48.36,43.85 50.65,43.85 IC1.15 | S4.3 37.16,15.28 43.33,15.28 S4.4 | S2.4 71.45,15.05 65.05,15.05 S2.3 64.82,15.05 60.71,15.05 S3.4 60.48,15.05 54.08,15.05 S3.3 52.25,13.22 | 52.25,13.22 50.65,11.62 50.65,7.51 U$2.5V | 52.25,13.22 v51.33,14.14 | 8.81,47.51 11.1,47.51 JP2.2 | 8.81,47.51 8.81,51.17 X3.1 | 8.81,47.51 JP2.1 | 7.9,7.05 7.9,16.65 12.01,20.76 12.01,23.74 X2.1 12.24,23.74 14.07,25.57 35.33,25.57 37.39,23.51 37.85,23.51 IC2.9 | v28.47,7.28 28.47,6.59 26.64,4.76 10.19,4.76 7.9,7.05 | 7.9,7.05 U$3.5V
  Bottom 0.254: IC2.9 38.07,23.51 38.07,23.97 42.87,28.77 42.87,30.82 IC2.18 43.1,31.05 38.07,36.08 IC1.9 38.07,36.31 43.1,41.34 43.1,43.62 IC1.18 | X1.1 73.05,43.62 66.42,50.25 66.42,50.48 65.51,51.4 63.91,51.4 62.31,49.8 56.82,49.8 50.88,43.85 IC1.15 | v51.33,14.14 48.36,14.14 47.45,15.05 43.56,15.05 S4.4 | JP2.1 8.58,47.28 8.58,43.4 7.9,42.71 7.9,28.08 9.73,26.25 10.19,26.25 12.01,24.42 12.01,23.97 X2.1 | v28.47,7.28 29.84,8.65 35.56,8.65 36.7,7.51 50.42,7.51 U$2.5V

### Text on the board
Top: e-blumenland.com
Bottom: e-blumenland.com